# EasyEDA schematic schematiic.json
TITLE: Sheet_1; REV: 1.0; Date: 2023-08-12; Sheet: 1/1; Drawn By: floppymon; Company: Your Company
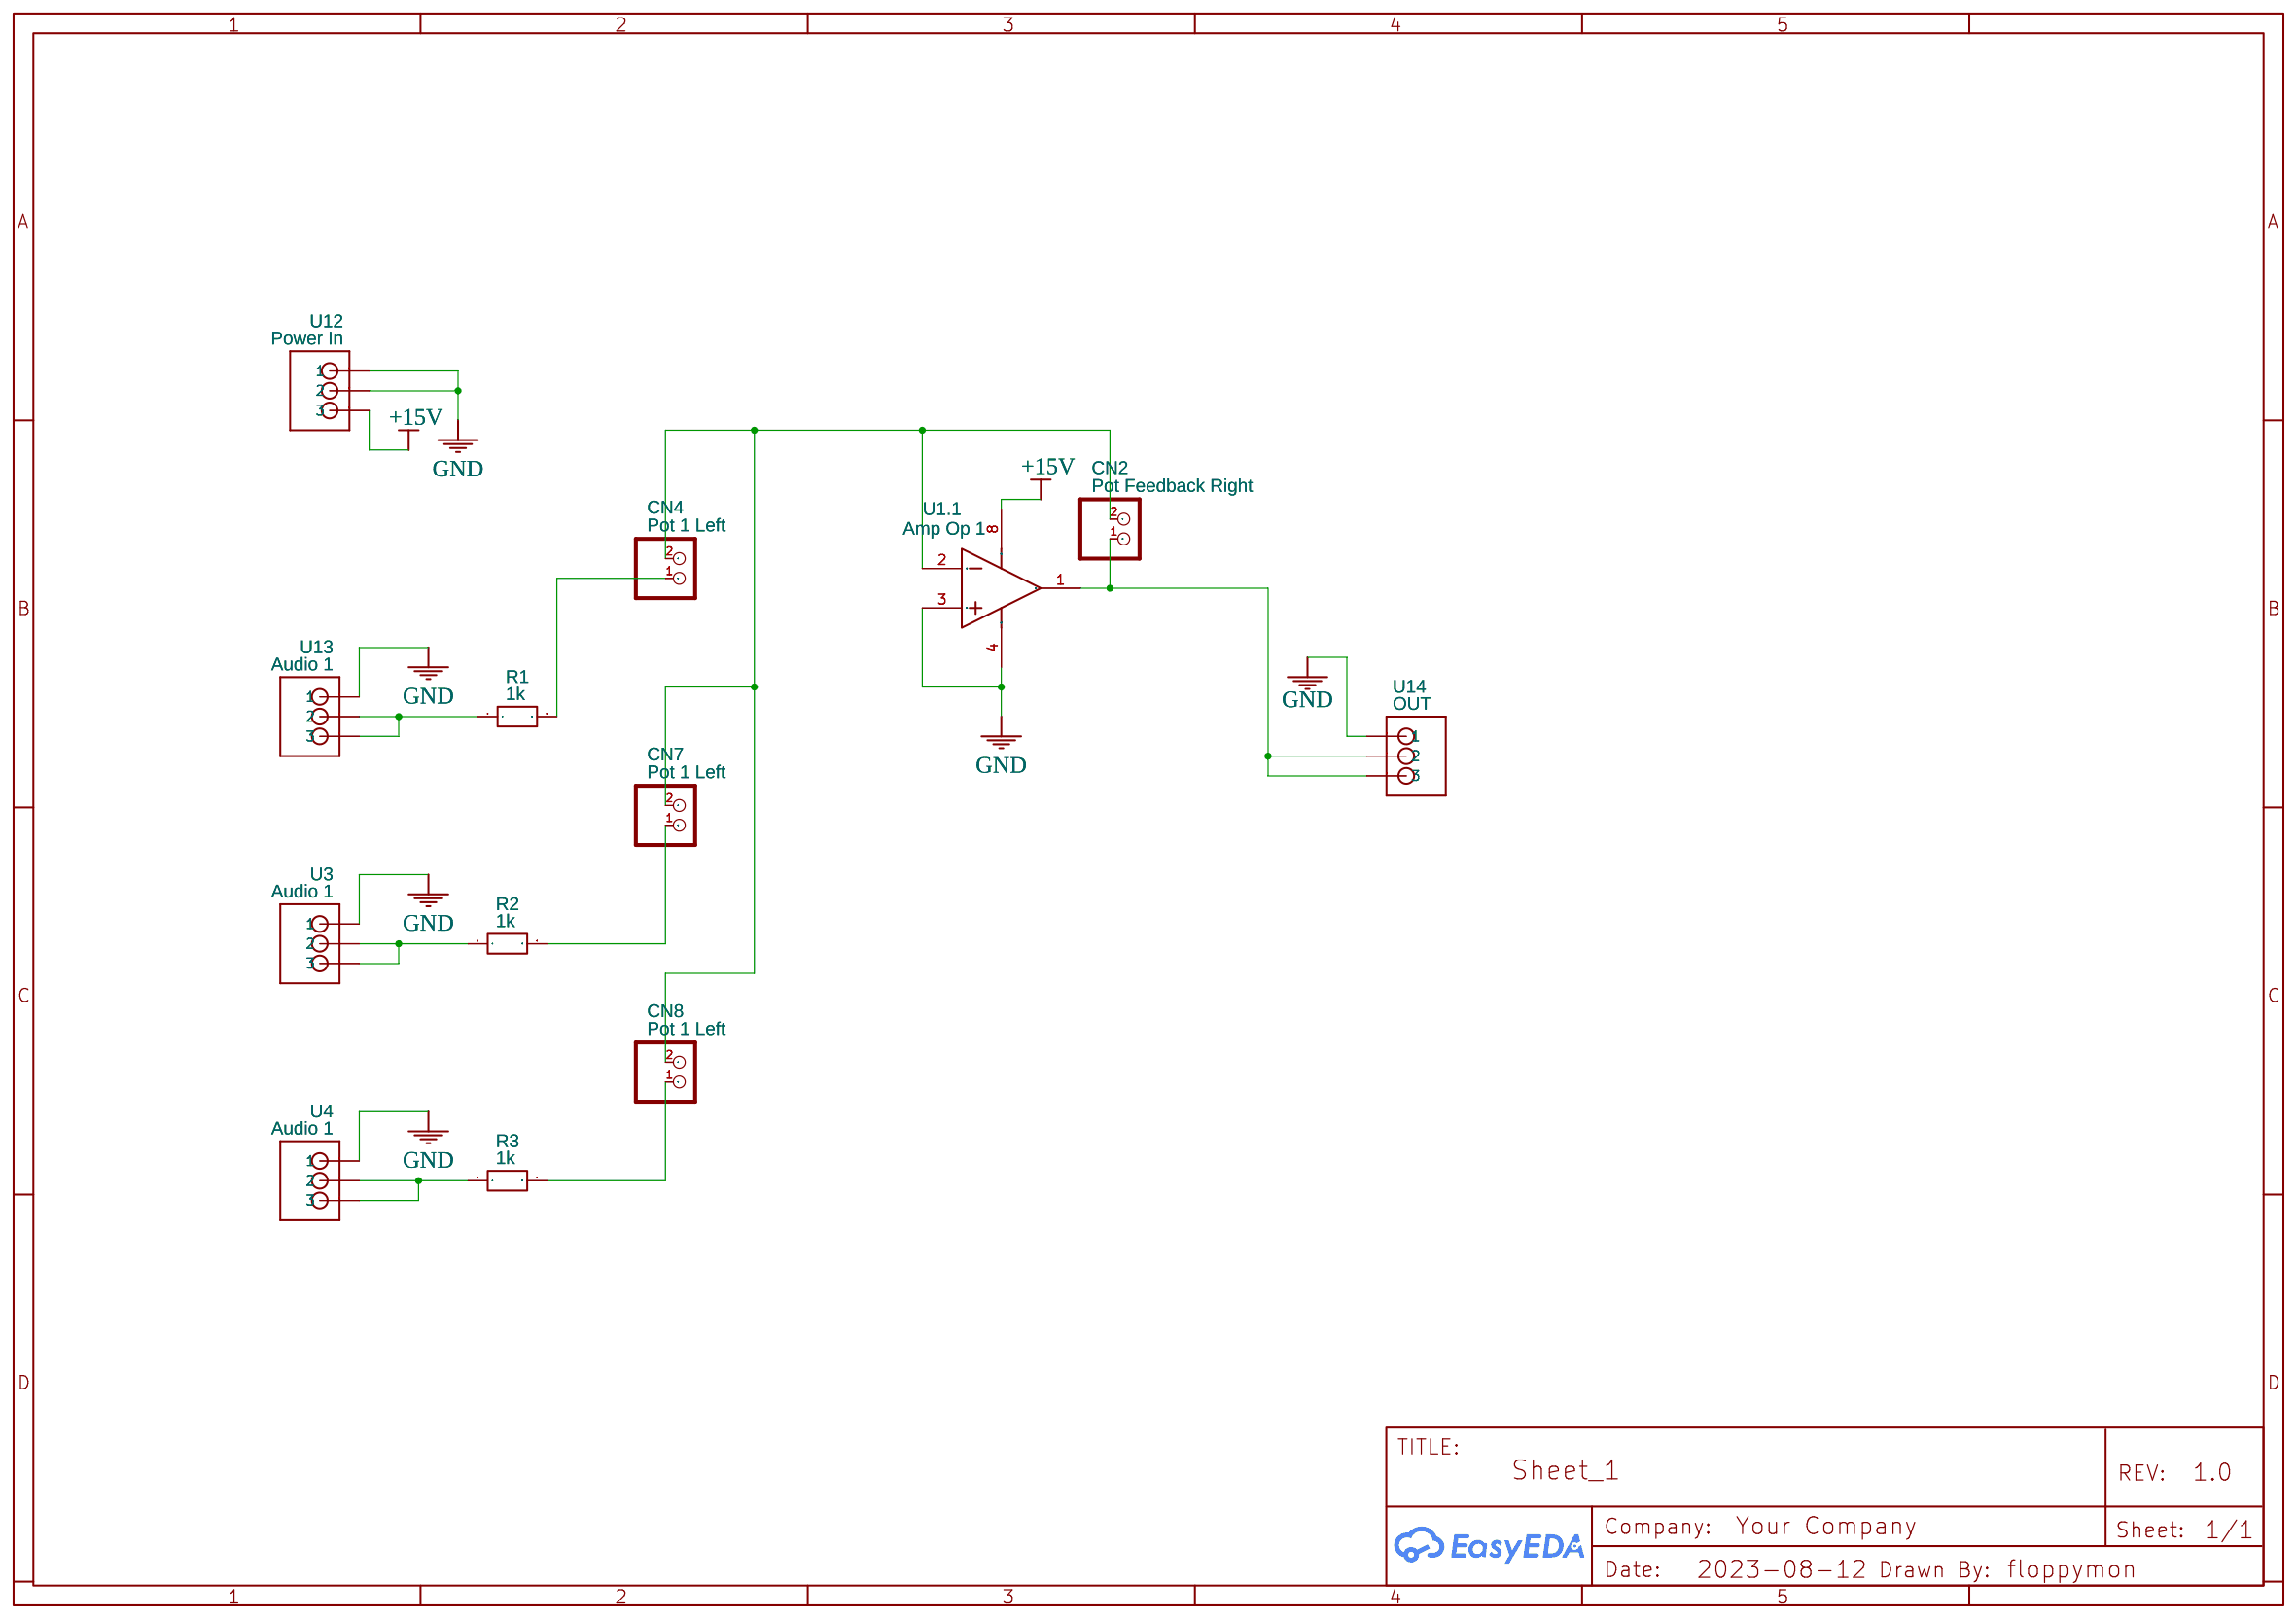
[diagram p0: schematic sheet]

## Parts
CN2  Pot Feedback Right  [JST-PH-2-THM]
CN4  Pot 1 Left  [JST-PH-2-THM]
CN7  Pot 1 Left  [JST-PH-2-THM]
CN8  Pot 1 Left  [JST-PH-2-THM]
R1  1k  [R_AXIAL-0.3]
R2  1k  [R_AXIAL-0.3]
R3  1k  [R_AXIAL-0.3]
U1  Amp Op 1  [DIP-8_L9.4-W6.4-P2.54-LS9.1-BL]  (section 1)
U3  Audio 1  [JST_B3B-PH_HEADER]
U4  Audio 1  [JST_B3B-PH_HEADER]
U12  Power In  [JST_B3B-PH_HEADER]
U13  Audio 1  [JST_B3B-PH_HEADER]
U14  OUT  [JST_B3B-PH_HEADER]

## Library data of the parts
CN2 CN4 CN7 CN8 = JST_2PIN-THM: JST 2-Pin Connectors of various flavors; Contributor: Adafruit
R1-R3 = R_AXIAL-0.3_EU: Contributor: LCEDA_Lib
U1 = NE5532P: tags: Audio Operational Amplifier; subpart_no: 1; image: http://image.lceda.cn/szlcsc/C5326.jpg; Supplier Part: C5326; Supplier: LCSC; Manufacturer: TI(德州仪器); JLCPCB Part Class: Extended Part; link: https://lcsc.com/eda_search?q=C5326&%26type=1&ref=editor
U3 U4 U12-U14 = JST-PH_3-PIN_HEADER

## Nets
+15V: U1.8(VCC+) U12.P3(3)
GND: U1.3(IN1+) U1.4(VCC-) U3.P1(1) U4.P1(1) U12.P1(1) U12.P2(2) U13.P1(1) U14.P1(1)
Net-(CN2-1): CN2.1(2) U1.1(OUT1) U14.P2(2) U14.P3(3)
Net-(CN2-2): CN2.2(1) CN4.2(1) CN7.2(1) CN8.2(1) U1.2(IN1-)
Net-(CN4-1): CN4.1(2) R1.2
Net-(CN7-1): CN7.1(2) R2.2
Net-(CN8-1): CN8.1(2) R3.2
Net-(R1-1): R1.1 U13.P2(2) U13.P3(3)
Net-(R2-1): R2.1 U3.P2(2) U3.P3(3)
Net-(R3-1): R3.1 U4.P2(2) U4.P3(3)
